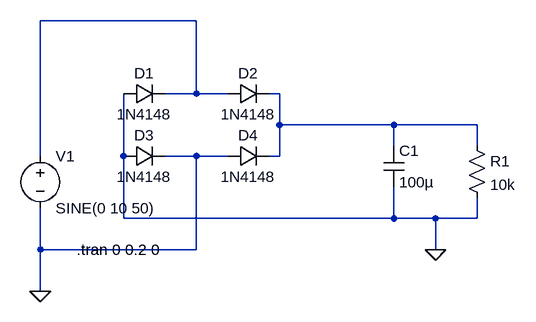
[diagram p0: schematic vezba1.asc]
vezba1.asc, the LTspice schematic file:
Version 4.1
SHEET 1 1072 680
WIRE 368 -80 128 -80
WIRE 368 32 368 -80
WIRE 368 32 320 32
WIRE 416 32 368 32
WIRE 496 32 480 32
WIRE 496 80 496 32
WIRE 672 80 496 80
WIRE 800 80 672 80
WIRE 672 112 672 80
WIRE 800 112 800 80
WIRE 128 128 128 -80
WIRE 256 128 256 32
WIRE 368 128 320 128
WIRE 416 128 368 128
WIRE 496 128 496 80
WIRE 496 128 480 128
WIRE 256 224 256 128
WIRE 672 224 672 176
WIRE 672 224 256 224
WIRE 736 224 672 224
WIRE 800 224 800 192
WIRE 800 224 736 224
WIRE 128 272 128 208
WIRE 368 272 368 128
WIRE 368 272 128 272
WIRE 736 272 736 224
WIRE 128 336 128 272
FLAG 128 336 0
FLAG 736 272 0
SYMBOL voltage 128 112 R0
WINDOW 123 24 124 Left 2
WINDOW 39 0 0 Left 0
SYMATTR InstName V1
SYMATTR Value SINE(0 10 50)
SYMBOL diode 256 48 R270
WINDOW 0 32 32 VTop 2
WINDOW 3 0 32 VBottom 2
SYMATTR InstName D1
SYMATTR Value 1N4148
SYMBOL diode 256 144 R270
WINDOW 0 32 32 VTop 2
WINDOW 3 0 32 VBottom 2
SYMATTR InstName D3
SYMATTR Value 1N4148
SYMBOL diode 416 48 R270
WINDOW 0 32 32 VTop 2
WINDOW 3 0 32 VBottom 2
SYMATTR InstName D2
SYMATTR Value 1N4148
SYMBOL diode 416 144 R270
WINDOW 0 32 32 VTop 2
WINDOW 3 0 32 VBottom 2
SYMATTR InstName D4
SYMATTR Value 1N4148
SYMBOL cap 656 112 R0
SYMATTR InstName C1
SYMATTR Value 100µ
SYMBOL res 784 96 R0
SYMATTR InstName R1
SYMATTR Value 10k
TEXT 184 272 Left 2 !.tran 0 0.2 0

The netlist it stands for:
* vezba1.asc
V1 N001 0 SINE(0 10 50)
D1 0 N001 1N4148
D3 0 0 1N4148
D2 N001 N002 1N4148
D4 0 N002 1N4148
C1 N002 0 100µ
R1 N002 0 10k
.model D D
.lib standard.dio
.tran 0 0.2 0
.backanno
.end